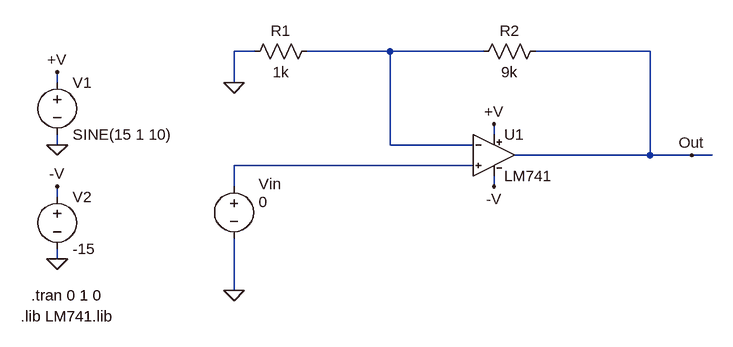
[diagram p0: schematic PSRR_Transient.asc]
PSRR_Transient.asc, the LTspice schematic file:
Version 4
SHEET 1 1464 1012
WIRE -432 272 -464 272
WIRE -224 272 -352 272
WIRE -80 272 -224 272
WIRE 176 272 0 272
WIRE -736 320 -736 304
WIRE -464 320 -464 272
WIRE -64 400 -64 384
WIRE -736 416 -736 400
WIRE -224 416 -224 272
WIRE -96 416 -224 416
WIRE 176 432 176 272
WIRE 176 432 -32 432
WIRE 240 432 176 432
WIRE 272 432 240 432
WIRE -96 448 -464 448
WIRE -464 480 -464 448
WIRE -64 480 -64 464
WIRE -736 496 -736 480
WIRE -736 592 -736 576
WIRE -464 640 -464 560
FLAG -464 640 0
FLAG 240 432 Out
FLAG -736 416 0
FLAG -736 592 0
FLAG -736 304 +V
FLAG -736 480 -V
FLAG -64 384 +V
FLAG -64 480 -V
FLAG -464 320 0
SYMBOL voltage -464 464 R0
WINDOW 123 38 63 Left 2
WINDOW 39 0 0 Left 2
WINDOW 0 38 12 Left 2
WINDOW 3 38 40 Left 2
SYMATTR InstName Vin
SYMATTR Value 0
SYMBOL res -336 256 R90
WINDOW 0 0 56 VBottom 2
WINDOW 3 32 56 VTop 2
SYMATTR InstName R1
SYMATTR Value 1k
SYMBOL res 16 256 R90
WINDOW 0 0 56 VBottom 2
WINDOW 3 32 56 VTop 2
SYMATTR InstName R2
SYMATTR Value 9k
SYMBOL voltage -736 304 R0
WINDOW 123 24 124 Left 2
WINDOW 39 0 0 Left 2
SYMATTR InstName V1
SYMATTR Value SINE(15 1 10)
SYMBOL voltage -736 480 R0
WINDOW 123 0 0 Left 2
WINDOW 39 0 0 Left 2
SYMATTR InstName V2
SYMATTR Value -15
SYMBOL LM741 -64 368 R0
SYMATTR InstName U1
TEXT -792 680 Left 2 !.lib LM741.lib
TEXT -776 648 Left 2 !.tran 0 1 0

The netlist it stands for:
* PSRR_Transient.asc
Vin N002 0 0
R1 N001 0 1k
R2 Out N001 9k
V1 +V 0 SINE(15 1 10)
V2 -V 0 -15
XU1 N002 N001 +V -V Out LM741  ; pins In+ In- V+ V- OUT
.lib LM741.lib
.tran 0 1 0
.lib LM741.lib
.backanno
.end